# Altium project cannonLed.PrjPcb
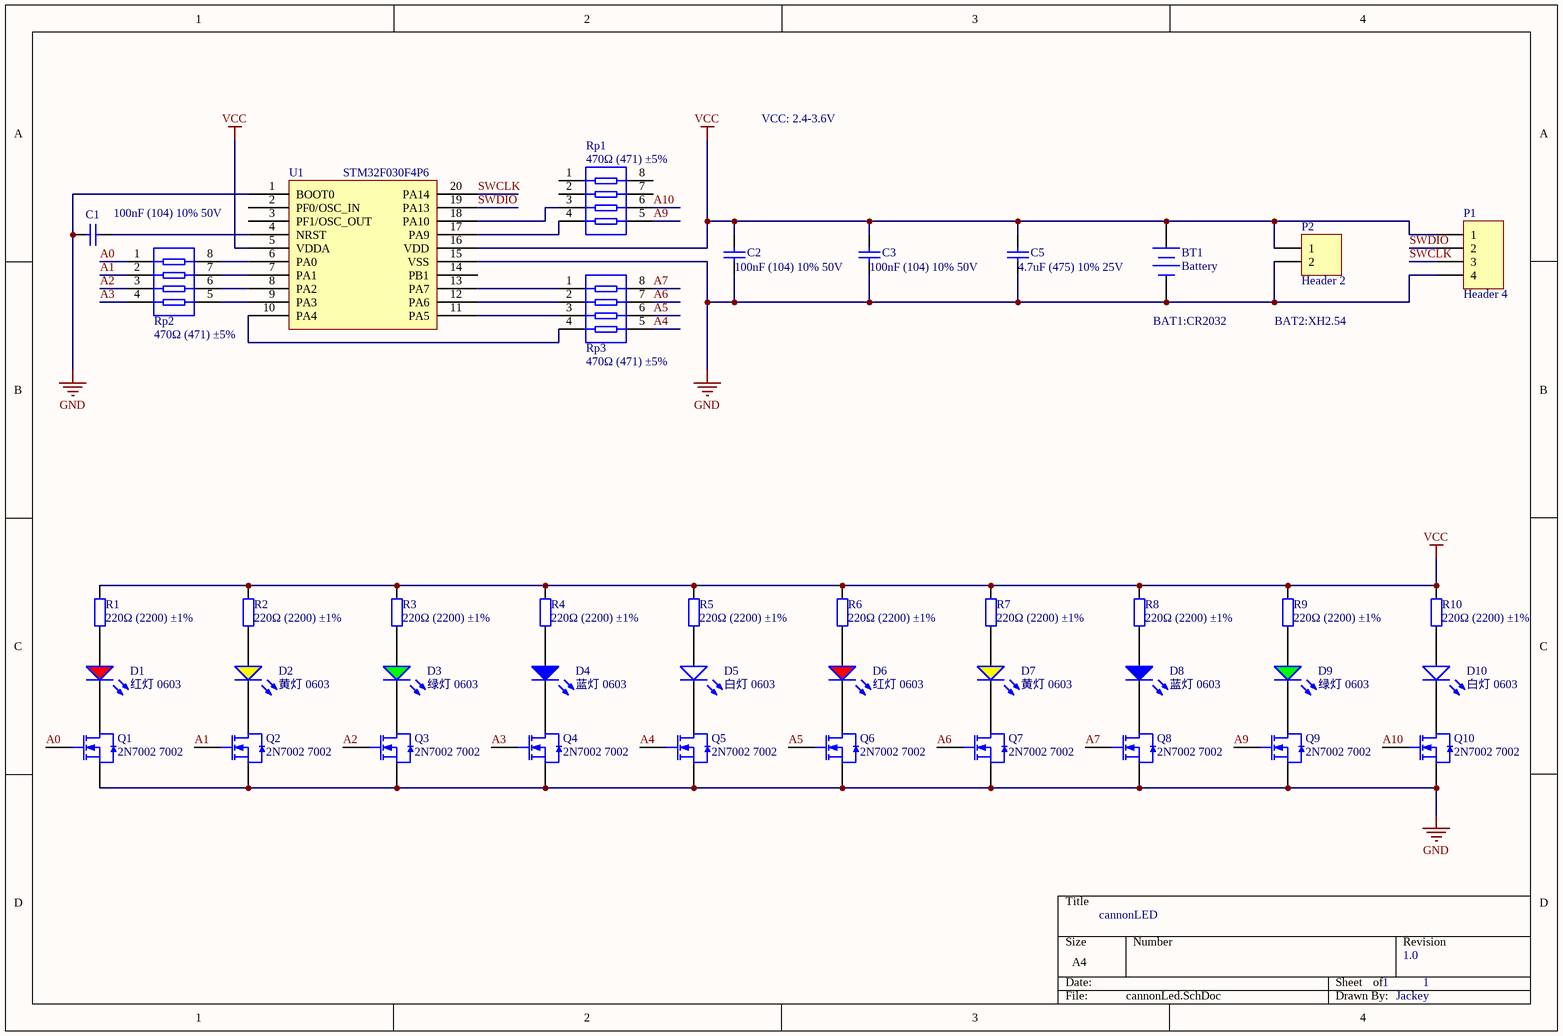
[diagram p0: cannonLed.SchDoc]
1 sheet, 41 parts. Net scope: global (net labels, ports and power ports of the same name join across sheets).
Board file: cannonLed.PcbDoc

## Sheet cannonLed.SchDoc: cannonLED
size A4; CompanyName: Tsinghua Univ.; DrawnBy: Jackey; Engineer: Jackey; Revision: 1.0; SheetNumber: 1; SheetTotal: 1

### Parts
BT1  Battery  [CR2032]
C1  100nF (104) 10% 50V  [0603_C]
C2  100nF (104) 10% 50V  [0603_C]
C3  100nF (104) 10% 50V  [0603_C]
C5  4.7uF (475) 10% 25V  [0805_C]
D1  红灯 0603  [0603_LED_S1]
D2  黄灯 0603  [0603_LED_S1]
D3  绿灯 0603  [0603_LED_S1]
D4  蓝灯 0603  [0603_LED_S1]
D5  白灯 0603  [0603_LED_S1]
D6  红灯 0603  [0603_LED_S1]
D7  黄灯 0603  [0603_LED_S1]
D8  蓝灯 0603  [0603_LED_S1]
D9  绿灯 0603  [0603_LED_S1]
D10  白灯 0603  [0603_LED_S1]
P1  Header 4  [HDR1X4]
P2  Header 2  [HDR1X2]
Q1  2N7002 7002  [SOT-23(SOT-23-3)]
Q2  2N7002 7002  [SOT-23(SOT-23-3)]
Q3  2N7002 7002  [SOT-23(SOT-23-3)]
Q4  2N7002 7002  [SOT-23(SOT-23-3)]
Q5  2N7002 7002  [SOT-23(SOT-23-3)]
Q6  2N7002 7002  [SOT-23(SOT-23-3)]
Q7  2N7002 7002  [SOT-23(SOT-23-3)]
Q8  2N7002 7002  [SOT-23(SOT-23-3)]
Q9  2N7002 7002  [SOT-23(SOT-23-3)]
Q10  2N7002 7002  [SOT-23(SOT-23-3)]
R1  220Ω (2200) ±1%  [0603_R]
R2  220Ω (2200) ±1%  [0603_R]
R3  220Ω (2200) ±1%  [0603_R]
R4  220Ω (2200) ±1%  [0603_R]
R5  220Ω (2200) ±1%  [0603_R]
R6  220Ω (2200) ±1%  [0603_R]
R7  220Ω (2200) ±1%  [0603_R]
R8  220Ω (2200) ±1%  [0603_R]
R9  220Ω (2200) ±1%  [0603_R]
R10  220Ω (2200) ±1%  [0603_R]
Rp1  470Ω (471) ±5%  [0603_Rx4]
Rp2  470Ω (471) ±5%  [0603_Rx4]
Rp3  470Ω (471) ±5%  [0603_Rx4]
U1  STM32F030F4P6  [TSSOP-20]

### Nets
GND: BT1.2(-) C1.1 C2.1 C3.1 C5.1 P1.4 P2.2 Q1.2(S) Q2.2(S) Q3.2(S) Q4.2(S) Q5.2(S) Q6.2(S) Q7.2(S) Q8.2(S) Q9.2(S) Q10.2(S) U1.1(BOOT0) U1.15(VSS)
VCC: BT1.1(+) C2.2 C3.2 C5.2 P1.1 P2.1 R1.2 R2.1 R3.1 R4.1 R5.1 R6.1 R7.1 R8.1 R9.1 R10.1 U1.5(VDDA) U1.16(VDD)
A0: Q1.1(G) Rp2.1
A1: Q2.1(G) Rp2.2
A2: Q3.1(G) Rp2.3
A3: Q4.1(G) Rp2.4
A4: Q5.1(G) Rp3.5
A5: Q6.1(G) Rp3.6
A6: Q7.1(G) Rp3.7
A7: Q8.1(G) Rp3.8
A9: Q9.1(G) Rp1.5
A10: Q10.1(G) Rp1.6
SWCLK: P1.3 U1.20(PA14)
SWDIO: P1.2 U1.19(PA13)
NetC1_2: C1.2 U1.4(NRST)
NetD1_A: D1.A R1.1
NetD1_K: D1.K Q1.3(D)
NetD2_A: D2.A R2.2
NetD2_K: D2.K Q2.3(D)
NetD3_A: D3.A R3.2
NetD3_K: D3.K Q3.3(D)
NetD4_A: D4.A R4.2
NetD4_K: D4.K Q4.3(D)
NetD5_A: D5.A R5.2
NetD5_K: D5.K Q5.3(D)
NetD6_A: D6.A R6.2
NetD6_K: D6.K Q6.3(D)
NetD7_A: D7.A R7.2
NetD7_K: D7.K Q7.3(D)
NetD8_A: D8.A R8.2
NetD8_K: D8.K Q8.3(D)
NetD9_A: D9.A R9.2
NetD9_K: D9.K Q9.3(D)
NetD10_A: D10.A R10.2
NetD10_K: D10.K Q10.3(D)
NetRp1_3: Rp1.3 U1.18(PA10)
NetRp1_4: Rp1.4 U1.17(PA9)
NetRp2_5: Rp2.5 U1.9(PA3)
NetRp2_6: Rp2.6 U1.8(PA2)
NetRp2_7: Rp2.7 U1.7(PA1)
NetRp2_8: Rp2.8 U1.6(PA0)
NetRp3_1: Rp3.1 U1.13(PA7)
NetRp3_2: Rp3.2 U1.12(PA6)
NetRp3_3: Rp3.3 U1.11(PA5)
NetRp3_4: Rp3.4 U1.10(PA4)

Not connected (* = marked no-connect by the designer): Rp1 1 2 7 8; U1 2(PF0/OSC_IN) 3(PF1/OSC_OUT) 14(PB1)

### Notes on the sheet
- VCC: 2.4-3.6V
- (near BT1) BAT1:CR2032
- BAT2:XH2.54
- Title
- Size:
- Date:
- A4
- Number:
- Time:
- Revision:
- Sheet
- of
- File:

### Library data of the parts
BT1 = Battery: Multicell Battery; Published: 24-Mar-1999; LatestRevisionDate: 17-Jul-2002; LatestRevisionNote: Re-released for DXP Platform.; PackageReference: BAT-2; Publisher: Altium Limited; PackageDescription: Battery; 2 Leads
C1-C3 = 0603 100nF (104) 10% 50V: 贴片电容; ComponentLink1Description: 供应商链接; ComponentLink1URL: http://www.szlcsc.com/product/details_15331.html; Package: 0603; Supplier: LC; SuppliersPartNumber: C14663
C5 = 0805 4.7uF (475) 10% 25V: 贴片电容; ComponentLink1Description: 供应商链接; ComponentLink1URL: http://www.szlcsc.com/product/details_2131.html; Package: 0805; Supplier: LC; SuppliersPartNumber: C1779
D1 D6 = 0603 红灯: 发光二极管; ComponentLink1Description: 供应商链接; ComponentLink1URL: http://www.szlcsc.com/product/details_2659.html; Package: 0603; Supplier: LC; SuppliersPartNumber: C2286
D2 D7 = 0603 黄灯: 发光二极管; ComponentLink1Description: 供应商链接; ComponentLink1URL: http://www.szlcsc.com/product/details_73147.html; Package: 0603; Supplier: LC; SuppliersPartNumber: C72038
D3 D9 = 0603 绿灯: 发光二极管; ComponentLink1Description: 供应商链接; ComponentLink1URL: http://www.szlcsc.com/product/details_73152.html; Package: 0603; Supplier: LC; SuppliersPartNumber: C72043
D4 D8 = 0603 蓝灯: 发光二极管; ComponentLink1Description: 供应商链接; ComponentLink1URL: http://www.szlcsc.com/product/details_73150.html; Package: 0603; Supplier: LC; SuppliersPartNumber: C72041
D5 D10 = 0603 白灯: 发光二极管; ComponentLink1Description: 供应商链接; ComponentLink1URL: http://www.szlcsc.com/product/details_2663.html; Package: 0603; Supplier: LC; SuppliersPartNumber: C2290
P1 = Header 4: Header, 4-Pin; LatestRevisionDate: 17-Jul-2002; LatestRevisionNote: Re-released for DXP Platform.; Publisher: Altium Limited
P2 = Header 2: Header, 2-Pin; LatestRevisionDate: 17-Jul-2002; LatestRevisionNote: Re-released for DXP Platform.; Publisher: Altium Limited
Q1-Q10 = 2N7002 7002: MOS(场效应管); ComponentLink1Description: 供应商链接; ComponentLink1URL: http://www.szlcsc.com/product/details_9040.html; Package: SOT-23(SOT-23-3); Supplier: LC; SuppliersPartNumber: C8545
R1-R10 = 0603 220Ω (2200) 1%: 贴片电阻; ComponentLink1Description: 供应商链接; ComponentLink1URL: http://www.szlcsc.com/product/details_23689.html; Package: 0603; Supplier: LC; SuppliersPartNumber: C22962
Rp1-Rp3 = 0603*4 470Ω (471) 5%: 贴片排阻; ComponentLink1Description: 供应商链接; ComponentLink1URL: http://www.szlcsc.com/product/details_26253.html; Package: 0603*4; Supplier: LC; SuppliersPartNumber: C25510
U1 = STM32F030F4P6: ARM; ComponentLink1Description: 供应商链接; ComponentLink1URL: http://www.szlcsc.com/product/details_33873.html; Package: TSSOP-20; Supplier: LC; SuppliersPartNumber: C32908